# Altium schematic sheet Obwody_zasilania.SchDoc
size A4
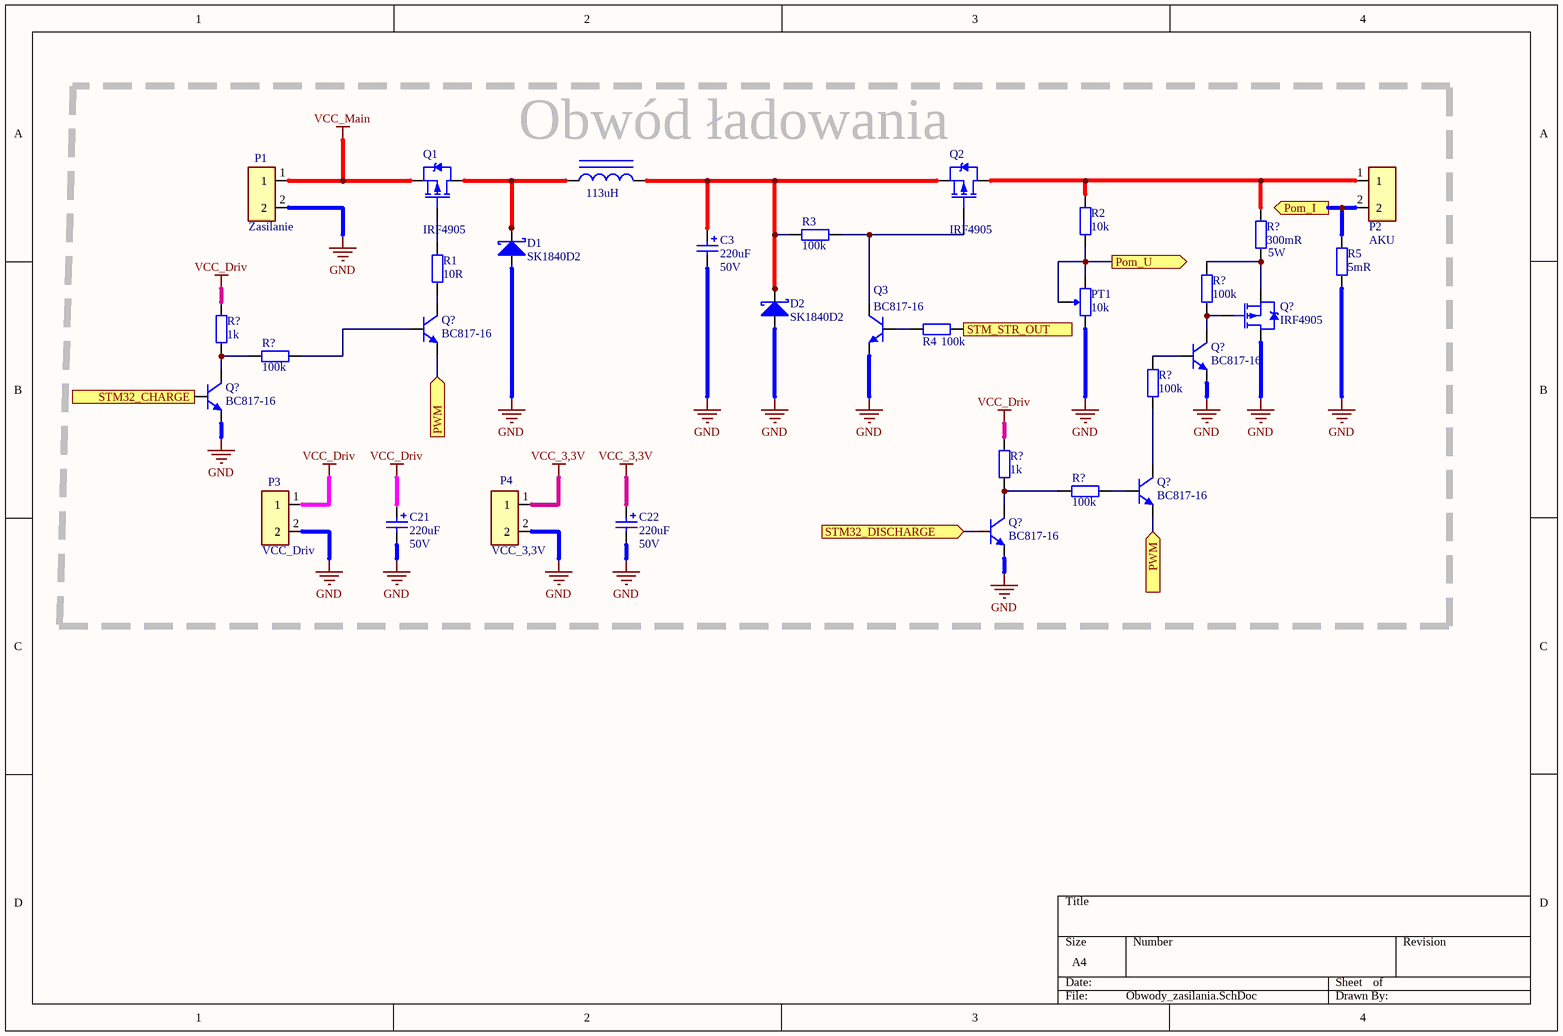
[diagram p0: Obwody_zasilania.SchDoc]

## Parts
(Parts that share a designator on the sheet are numbered #1, #2 ... from top to bottom, then left to right.)
C3  Parametr_1: 220uF  Parametr_2: 50V  [C_POL_D10x16]  (hidden comment: Kondesator elektrolityczny)
C21  Parametr_1: 220uF  Parametr_2: 50V  [C_POL_D8x11,5]  (hidden comment: Kondesator elektrolityczny)
C22  Parametr_1: 220uF  Parametr_2: 50V  [C_POL_D10x16]  (hidden comment: Kondesator elektrolityczny)
D1  SK1840D2  [D2PAK]
D2  SK1840D2  [D2PAK]
L1  Parametr_1: 113uH  [L-EXX/XX/X]  (hidden comment: Inductor Iron)
P1  Oznaczenie: Zasilanie  [ARK2-5mm]  (hidden comment: Złacze śrubowe)
P2  Oznaczenie: AKU  [ARK2-5mm]  (hidden comment: Złacze śrubowe)
P3  Oznaczenie: VCC_Driv  [ARK2-5mm]  (hidden comment: Złacze śrubowe)
P4  Oznaczenie: VCC_3,3V  [ARK2-5mm]  (hidden comment: Złacze śrubowe)
PT1  Parametr_1: 10k  [Potecjomert]  (hidden comment: Potentiometer)
Q1  IRF4905  [D2PAK]
Q2  IRF4905  [D2PAK]
Q3  BC817-16  [SOT323]
Q?#1  BC817-16  [SOT323]
Q?#2  IRF4905  [D2PAK]
Q?#3  BC817-16  [SOT323]
Q?#4  BC817-16  [SOT323]
Q?#5  BC817-16  [SOT323]
Q?#6  BC817-16  [SOT323]
R1  Parametr_1: 10R  [SMD-1206-RES]  (hidden comment: Rezystor)
R2  Parametr_1: 10k  [SMD-1206-RES]  (hidden comment: Rezystor)
R3  Parametr_1: 100k  [SMD-1206-RES]  (hidden comment: Rezystor)
R4  Parametr_1: 100k  [SMD-1206-RES]  (hidden comment: Rezystor)
R5  Parametr_1: 5mR  [SMD-2512-RES]  (hidden comment: Rezystor)
R?#1  Parametr_2: 5W  Parametr_1: 300mR  [SMD-1206-RES]  (hidden comment: Rezystor)
R?#2  Parametr_1: 100k  [SMD-1206-RES]  (hidden comment: Rezystor)
R?#3  Parametr_1: 1k  [SMD-1206-RES]  (hidden comment: Rezystor)
R?#4  Parametr_1: 100k  [SMD-1206-RES]  (hidden comment: Rezystor)
R?#5  Parametr_1: 100k  [SMD-1206-RES]  (hidden comment: Rezystor)
R?#6  Parametr_1: 1k  [SMD-1206-RES]  (hidden comment: Rezystor)
R?#7  Parametr_1: 100k  [SMD-1206-RES]  (hidden comment: Rezystor)

## Blocks framed on the sheet
Obwód ładowania: C3 C21 C22 D1 D2 L1 P1-P4 PT1 Q1-Q3 Q?#1-Q?#6 R1-R5 R?#1-R?#7

## Ports
Pom_I (out), Pom_U (out), PWM (in), STM32_CHARGE (in), STM32_DISCHARGE (in), STM_STR_OUT (in)

## Nets
GND: C3.1 C21.1 C22.1 D1.3(A) D2.3(A) P1.2 P3.2 P4.2 PT1.3(BOT) Q3.2(E) Q?#2.2(D) Q?#3.2(E) Q?#4.2(E) Q?#6.2(E) R5.1
VCC_3,3V: C22.2 P4.1
VCC_Driv: C21.2 P3.1 R?#3.2 R?#6.2
VCC_Main: P1.1 Q1.3(S)
Pom_I: P2.2 R5.2 ; port Pom_I
Pom_U: PT1.1(TOP) PT1.2(TAP) R2.2 ; port Pom_U
PWM: Q?#1.2(E) Q?#5.2(E) ; port PWM
STM32_CHARGE: Q?#4.1(B) ; port STM32_CHARGE
STM32_DISCHARGE: Q?#6.1(B) ; port STM32_DISCHARGE
STM_STR_OUT: R4.1 ; port STM_STR_OUT
NetC3_2: C3.2 D2.1(K) D2.4(A) L1.5 Q2.3(S) R3.2
NetD1_1: D1.1(K) D1.4(A) L1.1 Q1.2(D)
NetP2_1: P2.1 Q2.2(D) R2.1 R?#1.1
NetQ1_1: Q1.1(G) R1.2
NetQ2_1: Q2.1(G) Q3.3(C) R3.1
NetQ3_1: Q3.1(B) R4.2
NetQ?#1_1: Q?#1.1(B) R?#4.2
NetQ?#1_3: Q?#1.3(C) R1.1
NetQ?#2_1: Q?#2.1(G) Q?#3.3(C) R?#2.2
NetQ?#2_3: Q?#2.3(S) R?#1.2 R?#2.1
NetQ?#3_1: Q?#3.1(B) R?#5.2
NetQ?#4_3: Q?#4.3(C) R?#3.1 R?#4.1
NetQ?#5_1: Q?#5.1(B) R?#7.2
NetQ?#5_3: Q?#5.3(C) R?#5.1
NetQ?#6_3: Q?#6.3(C) R?#6.1 R?#7.1

## Library data of the parts
C3 C21 C22 = Kondesator elektrolityczny: Dostawca: TME; Montaż: THT; Obudowa: D10x16; Parametr_3: Tolerancja:; Parametr_4: Czas życzia:; Parametr_5: Temperatura pracy:; Nazwa: Kondesator elektrolityczny
  C3: Kod TME: ECA1EHG101
  C21 C22: Kod TME: JRG-220U/25
D1 D2 = SK1840D2: Dioda Schottky; Dostawca: TME; Montaż: SMD; Parametr_1: Prąd: 18A; Parametr_2: Max prąd imp.: 280A; Parametr_3: Max nap. wsteczne: 40V; Producent: DIOTEC SEMICONDUCTOR; Nazwa: Dioda Schottky; Obudowa: D2PAK; Oznaczenie: SK1840D2; Kod TME: SK1840D2-DIO
L1 = Inductor Iron: Magnetic-Core Inductor; Parametr_2: Ilość zwoji:; Parametr_3: Średnica drutu:; Revision: July-2002: Re-released for DXP Platform.
P1-P4 = Złacze śrubowe: Dostawca: TME; Montaż: THT; Nazwa: Listwa zaciskowa do druku, XY301V-2P; Parametr_1: 250VDC/AC; Parametr_2: 24A; Parametr_3: 2,5mm2; Producent: DEGSON ELECTRONICS; Kod TME: DG300-5.0-2P12
PT1 = Potentiometer: Potentiometer montażowy wielobortowy; Parametr_2: Moc:; Parametr_3: Tolerancja:; Parametr_4: Charakterystyka:; Parametr_5: Temperatura pracy:; Parametr_6: Max nap. pracy:; Nazwa: Potentiometer montażowy wielobortowy
Q1 Q2 Q?#2 = IRF4905: Traznystor MOSFET-P; Nazwa: Tranzystor MOSFET-P; Parametr_1: Prąd drenu: -74A; Parametr_2: Nap. dren-żródło: -55V; Parametr_3: Nap. bramka-żródło: -/+20V; Parametr_4: Rezystacja w stanie przewodzenia: 20mOhm; Parametr_6: Moc rozpraszana: 200W; Oznaczenie: IRF4905
Q3 Q?#1 Q?#3-Q?#6 = BC817-16: Tranzystor bipolarny PNP; Dostawca: TME; Montaż: SMD; Producent: DIOTEC SEMICONDUCTOR; Parametr_3: Npa. C-E: 45V; Parametr_4: Wzmocnienie: 100-250; Parametr_5: Częstotliwość: 100Mhz; Parametr_2: Prąd kolektora: 0,8A; Nazwa: Tranzystor bipolarny PNP; Obudowa: SOT323; Oznaczenie: BC817-16; Kod TME: BC817-16-DIO
R1-R4 R?#2-R?#7 = Rezystor: Dostawca: TME; Montaż: SMD; Obudowa: 1206; Parametr_2: Moc: 0,250W; Parametr_3: Tolerancja: 5%; Parametr_4: Max nap. pracy:; Parametr_5: Max nap impulsowe:; Nazwa: Rezystor
  R1: Kod TME: AC1206FR-0710RL
  R2-R4 R?#2-R?#7: Kod TME: SMD1206-100K
R5 = Rezystor: Dostawca: TME; Montaż: SMD; Obudowa: 2512; Parametr_2: Moc: 1W; Parametr_3: Tolerancja: 1%; Parametr_4: Max nap. pracy:; Parametr_5: Max nap impulsowe:; Nazwa: Rezystor; Kod TME: WW12RR005FTL
R?#1 = Rezystor: Dostawca: TME; Montaż: SMD; Obudowa: 1206; Parametr_3: Tolerancja: 5%; Parametr_4: Max nap. pracy:; Parametr_5: Max nap impulsowe:; Nazwa: Rezystor; Kod TME: SMD1206-100K